# EAGLE design v1 (EAGLE 7.1.0)
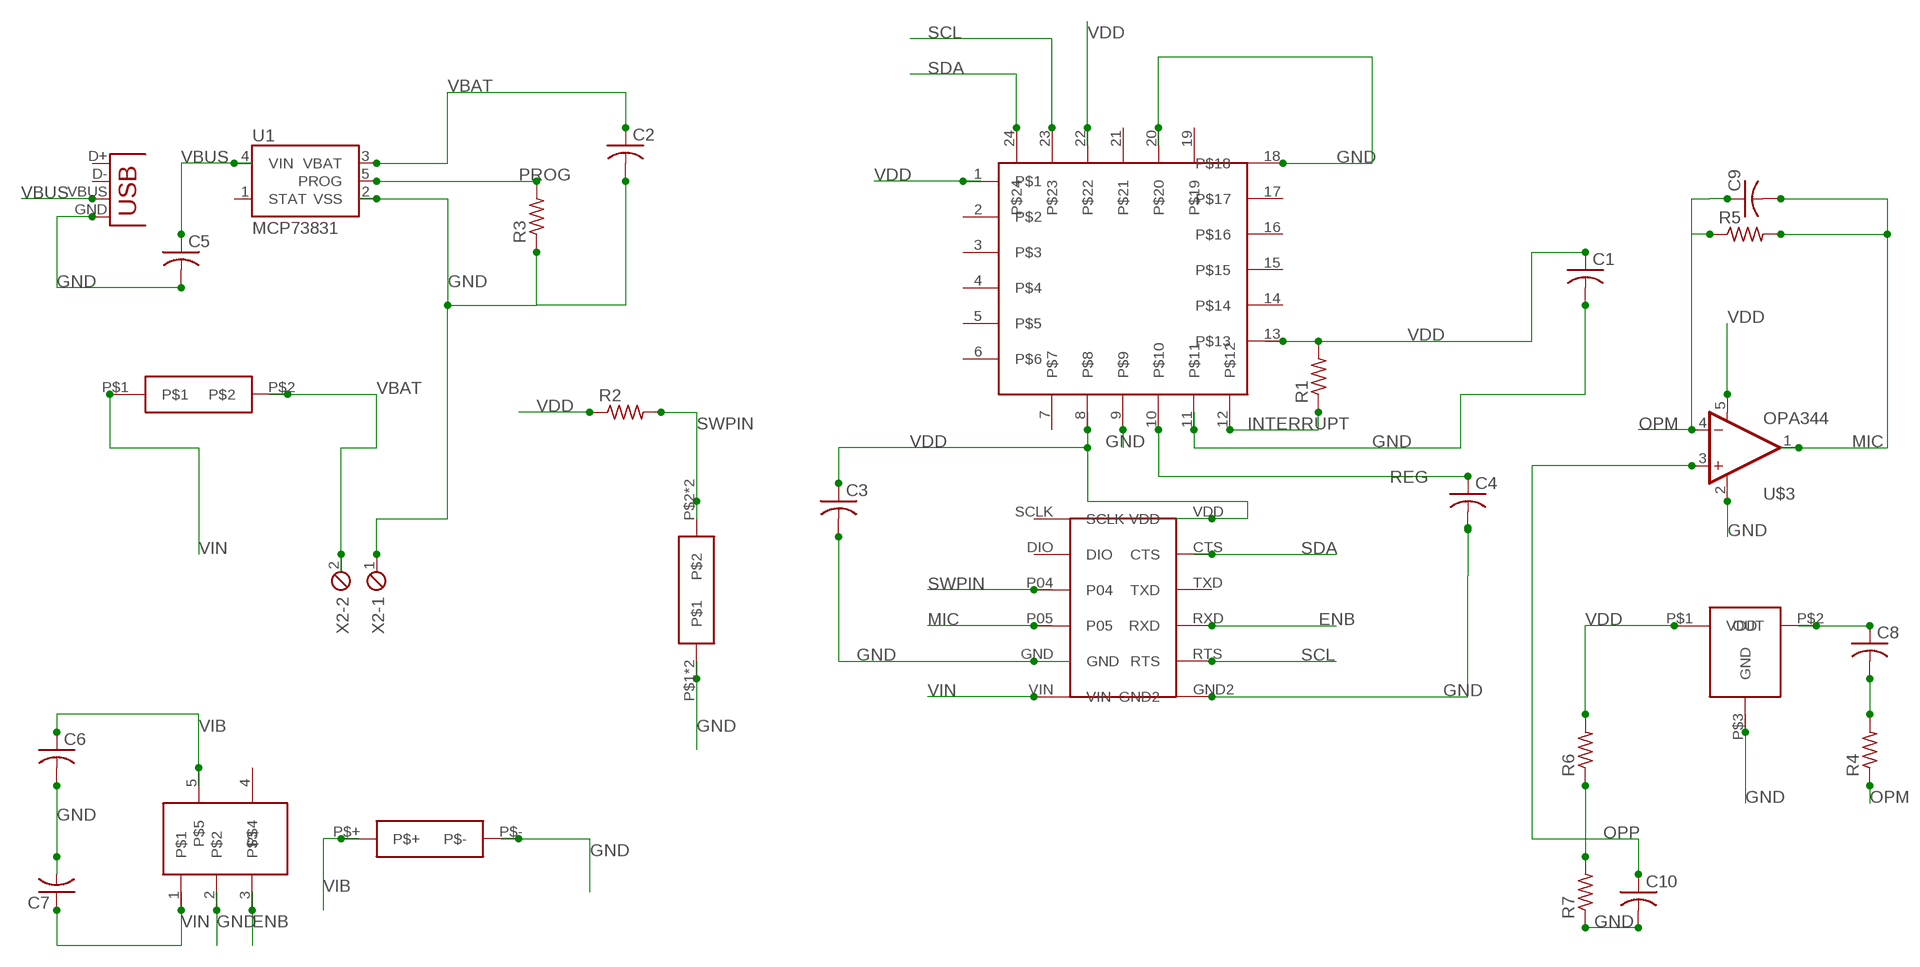
[diagram p0: schematic, sheet 1]

## Parts
C1  C-USC0402K  [C0402K]
C2  C-USC0402K  [C0402K]
C3  C-USC0402K  [C0402K]
C4  C-USC0402K  [C0402K]
C5  C-USC0402K  [C0402K]
C6  C-USC0402K  [C0402K]
C7  C-USC0402K  [C0402K]
C8  C-USC0402K  [C0402K]
C9  C-USC0402K  [C0402K]
C10  C-USC0402K  [C0402K]
R1  R-US_R0402  [R0402]
R2  R-US_R0402  [R0402]
R3  R-US_R0402  [R0402]
R4  R-US_R0402  [R0402]
R5  R-US_R0402  [R0402]
R6  R-US_R0402  [R0402]
R7  R-US_R0402  [R0402]
U1  MCP73831  [SOT23-5]
U$1  NANOBLE  [NANOBLE]
U$2  MICROPHONE  [MICROPHONE]
U$3  OPA344  [SOT23-5]
U$4  LP5907  [SOT23-5]
U$5  TACTILE  [TACTILE]
U$6  SWITCH  [SWITCH2]
U$7  VIBRATOR  [VIBRATOR]
U$8  COMPASSE  [QFN-24-USB]
X1  USB-MICROB  [USB-MICROB]
X2  MPT2  [2POL254]

## Nets
ENB: U$1.RXD U$4.3
GND: C1.2 C2.2 C3.2 C4.2 C5.2 C6.2 C7.2 C10.2 R3.1 R7.1 U1.2(VSS) U$1.GND U$1.GND2 U$2.P$3(GND) U$3.2(V-) U$4.2 U$5.P$1 U$5.P$3 U$7.P$- U$8.9 U$8.11 U$8.18 U$8.20 X1.GND X2.1
INTERRUPT: R1.1 U$8.12
MIC: C9.2 R5.2 U$1.P05 U$3.1(OUT)
N$1: C8.2 R4.2
N$3: C8.1 U$2.P$2(OUT)
OPM: C9.1 R4.1 R5.1 U$3.4(-IN)
OPP: C10.1 R6.1 R7.2 U$3.3(+IN)
PROG: R3.2 U1.5(PROG)
REG: C4.1 U$8.10
SCL: U$1.RTS U$8.23
SDA: U$1.CTS U$8.24
SWPIN: R2.2 U$1.P04 U$5.P$2 U$5.P$4
VBAT: C2.1 U1.3(VBAT) U$6.P$2 X2.2
VBUS: C5.1 U1.4(VIN) X1.VBUS
VDD: C1.1 C3.1 R1.2 R2.1 R6.2 U$1.VDD U$2.P$1(VDD) U$3.5(V+) U$8.1 U$8.8 U$8.13 U$8.22
VIB: C6.1 U$4.5 U$7.P$+
VIN: C7.1 U$1.VIN U$4.1 U$6.P$1
Unconnected: U1.1(STAT) U$1.DIO U$1.SCLK U$1.TXD U$4.4 U$8.2 U$8.3 U$8.4 U$8.5 U$8.6 U$8.7 U$8.14 U$8.15 U$8.16 U$8.17 U$8.19 U$8.21 X1.D+ X1.D-

## Library data of the parts
C1-C10 = rcl:C-US: CAPACITOR, American symbol
R1-R7 = rcl:R-US_: RESISTOR, American symbol
U1 = ahmed:MCP73831: Microchip's MCP73831 Miniature single cell, fully integrated Li-Ion, Li-polymer charge management controller http://ww1.microchip.com/downloads/en/DeviceDoc/21984a.pdf
U$1 = ahmed:NANOBLE
U$2 = ahmed:MICROPHONE
U$3 = ahmed:OPA344
U$4 = ahmed:LP5907
U$5 = ahmed:TACTILE
U$6 = ahmed:SWITCH
U$7 = ahmed:VIBRATOR
U$8 = ahmed:COMPASSE
X1 = ahmed:USB: USB Connectors USB-B-PTH is fully proven SKU : PRT-00139 USB-miniB is fully proven SKU : PRT-00587 USB-A-PCB is untested. USB-A-H is throughly reviewed, but untested. Spark Fun Electronics SKU : PRT-00437 USB-B-SMT is throughly reviewed, but untested. Needs silkscreen touching up. USB-A-S has not been used/tested USB-MB-H has not been used/tested
X2 = con-phoenix-254:MPT2: PHOENIX CONNECTOR; OC_FARNELL: unknown; OC_NEWARK: unknown

## Board
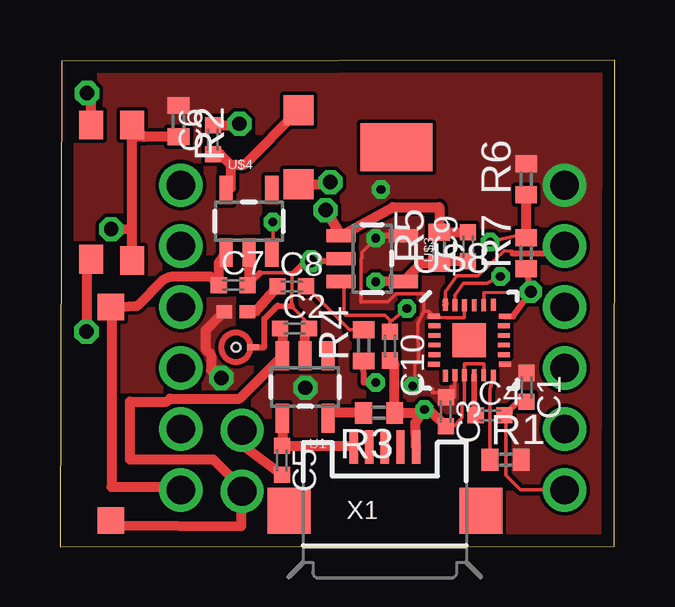
[diagram p1: board, top side]
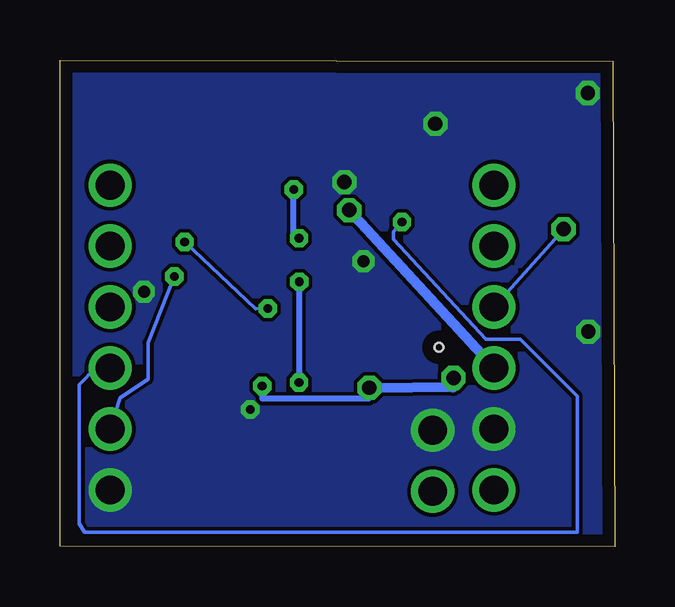
[diagram p2: board, bottom side, seen from below]

Size 23.14 x 20.29 mm. Coordinates in mm from the lower left corner, seen from the top.
Outline: 0,0 23.12,0.02 23.14,20.29 0.08,20.24 0,0
Copper layers (1*16): Top 0.0178mm / dielectric 59mil / Bottom 0.0178mm
Design rules "SSC-EAGLE-2Lyr_v1.0.0.3": minimum track width 6mil, minimum drill 14mil, track to track 6mil, track to pad 6mil, pad to pad 6mil, via to via 6mil, smd to smd 6mil, copper to edge 20mil, drill to drill 16mil, minimum pad ring 8mil, minimum via ring 8mil, stop-mask expansion 3mil, vias tented up to drill 0mil, thermal gap 10mil

### Footprints (pad centres in the part's own frame; a part is rotated, then mirrored left to right if it is on the bottom)
C0402K = smd 0.671 x 0.664: 1 -0.6,0; 2 0.6,0
R0402 = smd 0.7 x 0.9: 1 -0.65,0; 2 0.65,0
SOT23-5 = smd 0.55 x 1.2: 1 -0.95,-1.3; 2 0,-1.3; 3 0.95,-1.3; 4 0.95,1.3; 5 -0.95,1.3
NANOBLE = drill 1.2: CTS 8.001,3.81; DIO -8.001,3.81; GND -8.001,-3.81; GND2 8.001,-6.35; P04 -8.001,1.27; P05 -8.001,-1.27; RTS 8.001,-3.81; RXD 8.001,-1.27; SCLK -8.001,6.35; TXD 8.001,1.27; VDD 8.001,6.35; VIN -8.001,-6.35
MICROPHONE = smd 0.65 x 0.545: P$1 -0.475,1.478; P$2 0.475,1.478 | smd 0.5 x 0.25: P$3 0.725,0 | hole 0.36: 0,0
TACTILE = smd 1.2 x 1: P$1 2.8,0.85; P$2 2.8,-0.85; P$3 -2.8,0.85; P$4 -2.85,-0.85
SWITCH2 = smd 1.1 x 1.1: P$1 0,4.45; P$2 0,-4.45
VIBRATOR = smd 1.25 x 1.25: P$+ -1.54,-2.54; P$- 1.54,-2.54 | smd 2 x 3: USELESS 0,1.54
QFN-24-USB = smd 0.5 x 0.2: 1 -1.475,1; 2 -1.45,0.6; 3 -1.45,0.2; 4 -1.45,-0.2; 5 -1.45,-0.6; 6 -1.475,-1; 13 1.475,-1; 14 1.45,-0.6; 15 1.45,-0.2; 16 1.45,0.2; 17 1.45,0.6; 18 1.475,1 | smd 0.2 x 0.5: 7 -1,-1.475; 8 -0.6,-1.45; 9 -0.2,-1.45; 10 0.2,-1.45; 11 0.6,-1.45; 12 1,-1.475; 19 1,1.475; 20 0.6,1.45; 21 0.2,1.45; 22 -0.2,1.45; 23 -0.6,1.45; 24 -1,1.475 | smd 1.398 x 1.398: GND1 0,0; GND2 0,0
USB-MICROB = smd 0.35 x 1.4: D+ 0,2.65; D- -0.65,2.65; GND 1.3,2.65; ID 0.65,2.65; VBUS -1.3,2.65 | smd 1.8 x 1.9: MT1 -4,0; MT2 4,0
2POL254 = drill 1.2: 1 -1.27,0; 2 1.27,0

### Placement (x,y rotation side)
C1  19.45,6.65 270 top
C2  9.78,9.1 0 top
C3  16.09,5.64 270 top
C4  17.93,5.48 0 top
C5  9.25,3.61 270 top
C6  6.38,16.97 90 top
C7  7.23,10.91 0 top
C8  9.67,10.86 0 top
C9  17.02,12.51 90 top
C10  13.76,8.37 270 top
R1  18.58,3.63 0 top
R2  4.95,17.74 270 top
R3  13.31,5.59 180 top
R4  12.66,8.4 90 top
R5  15.81,12.46 90 top
R6  19.44,15.32 90 top
R7  19.44,12.24 90 top
U1  10.22,6.67 180 top
U$1  13.04,8.73 0 top
U$2  7.34,8.33 0 top
U$3  13.02,12.01 270 top
U$4  7.88,13.57 0 top
U$5  2.16,14.78 90 top
U$6  2.13,5.55 0 top
U$7  12.49,16.65 270 top
U$8  17.07,8.61 0 top
X1  13.55,1.51 0 top
X2  7.59,3.59 270 top

### Tracks (layer width: path | path; a pad name or v marks a point on that pad's centre or on a via)
ENB  (via drill 0.36)
  Top 0.154: v8.88,13.54 8.88,12.32 U$4.3
  Bottom 0.154: U$1.RXD 21.64,7.46 22.34,6.76 22.34,0.97 22.1,0.62 1.57,0.62 1.57,6.28 3.95,8.66 5.37,8.66 9.24,12.81 9.24,13.13 v8.88,13.54
GND  (via drill 0.36, 0.5, 0.6)
  Top 0.154: U$8.20 17.68,10.58 v19.64,10.63 | 8.34,11.42 9.76,11.42 9.67,11.33 9.66,10.04 10.4,9.27 C2.2 | 19.1,6.05 18.6,5.55 18.6,2.98 19.2,2.38 U$1.GND2 | 16.87,7.56 U$8.9 16.87,6.01 16.77,5.93 16.77,5.39 16.41,5.01 C3.2 | 16.87,7.56 16.94,7.64 | U$8.11 17.67,7.64 16.94,7.64 | 16.94,7.64 16.87,7.64 16.87,7.56
  Top 0.254: U$8.18 18.89,9.61 v19.64,10.63 19.47,11.56 R7.1 | C1.2 19.1,6.05 C4.2 | U$3.2 11.39,11.91 v10.48,11.9 10.24,11.9 9.76,11.42 | C7.2 8.34,11.42 | U$2.P$3 8.52,8.33 8.52,9.51 8.98,9.97 8.96,9.95 9.08,10.05 9.66,10.04
  Top 0.406: X2.1 7.62,4.24 C5.2 | U$5.P$1 1.31,18.8 v1.13,18.91 | U$5.P$3 1.11,11.82 v1.11,8.97 | C6.2 7.42,17.57 v7.49,17.63 | U$7.P$- 11,15.11 v11.28,15.2 | X1.GND 14.82,5.18 v15.2,5.73 | v15.2,5.73 15.08,5.59 R3.1 13.96,7.57 C10.2 | v15.2,5.73 15.46,5.64 C3.2 | U1.2 10.22,8.85 C2.2 | U$4.2 7.88,10.96 C7.2
  Bottom 0.254: v19.64,10.63 19.85,10.6 19.7,10.56 | v10.48,11.9 10.38,11.8
  Bottom 0.406: v1.13,18.91 1.3,18.95 | v1.11,8.97 1.09,9.16 1.08,8.99 | v7.49,17.63 v7.49,17.62 7.5,17.57 | v11.28,15.2 11.23,15.34 | v15.2,5.73 15.26,5.75 15.22,5.8
  pour Bottom (no thermals): -0.1,20.05 -0.17,0.06 22.38,-0.12 22.45,19.87
INTERRUPT
  Top 0.154: R1.1 17.92,6.53 U$8.12
MIC  (via drill 0.6)
  Top 0.406: v11.08,14.03 U$3.1 13.88,14.16 15.82,14.16 R5.2 C9.2
  Bottom 0.406: U$1.P05 v11.08,14.03
N$1
  Top 0.154: C8.2 12.08,9.05 R4.2
N$3
  Top 0.406: U$2.P$2 8.11,9.78 C8.1
OPM  (via drill 0.36)
  Top 0.254: v13.17,6.85 12.67,6.85 R4.1
  Top 0.406: C9.1 15.81,11.91 R5.1 15.06,11.81 U$3.4 v13.16,11.05
  Bottom 0.254: v13.16,11.05 13.17,6.82 v13.17,6.85
OPP  (via drill 0.36)
  Top 0.154: U$3.3 11.85,10.93 11.85,9.71 11.91,9.65 13.56,9.65 13.76,9.45 13.76,9.36 | R7.2 19.29,13.03 v17.94,12.71 | v14.47,9.94 13.76,9.36 | 13.76,9.36 C10.1
  Top 0.406: R6.1 R7.2
  Bottom 0.154: v17.94,12.71 14.98,9.93 v14.47,9.94
PROG
  Top 0.406: R3.2 11.39,5.59 U1.5
REG
  Top 0.254: U$8.10 17.27,5.55 C4.1
SCL  (via drill 0.36)
  Top 0.154: U$8.23 16.48,10.48 16.83,10.98 17.8,10.98 v18.37,11.26
  Bottom 0.154: v18.37,11.26 19.47,8.51 19.47,6.98 20.62,6.22 U$1.RTS
SDA
  Top 0.154: U$8.24 16.07,10.07 16.08,10.63 16.55,11.29 17.42,11.29 18.53,12.34 18.87,12.32 18.87,12.23
  Top 0.254: 16.07,10.22 16.07,10.07 | 18.87,12.23 20.74,12.23 U$1.CTS
SWPIN  (via drill 0.6)
  Top 0.406: R2.2 3.5,17.09 | 3.5,17.09 U$5.P$2 | 3.5,17.09 3.11,17.09 2.94,17.26 3.08,17.26 3.15,17.19 3.09,17.19 3,17.1 3,13.25 | 3,13.25 3,11.95 U$5.P$4 | v2.14,13.24 3,13.25
  Bottom 0.154: U$1.P04 v2.14,13.24
VBAT
  Top 0.406: U$6.P$2 2.33,1.16 2.33,0.91 7.57,0.87 X2.2 7.59,2.44 6.4,3.64 3.4,3.64 2.92,3.64 2.92,6.06 4.45,6.06 4.58,6.18 7.49,6.18 U1.3 9.27,9.03 C2.1
VBUS
  Top 0.406: U1.4 9.27,4.23 C5.1 12.19,4.21 X1.VBUS
VDD  (via drill 0.36, 0.6)
  Top 0.154: U$8.22 16.87,9.58 16.84,9.55 16.1,9.55 15.37,9.56 U$8.1 15.39,9.81 15.18,9.81 | v14.71,6.71 14.63,6.71 14.61,6.88 | C3.1 16.47,6.24 16.47,6.68 | U$8.8 16.47,6.68 | 16.47,6.68 16.3,6.68 16.3,6.42 15.54,6.42 15.54,6.6 14.81,6.6 14.81,7.67 14.95,7.67 14.93,9.35 15.18,9.81 | 15.18,9.81 15.18,10.55 14.01,10.55 13.67,10.21 12.58,10.21 12.55,10.2 12.55,12.01 12.59,12.03 12.59,12.28 v13.17,12.86
  Top 0.254: U$3.5 13.08,12.96 v13.17,12.86 | v13.39,14.89 13.48,14.89 13.38,14.86
  Top 0.406: U$2.P$1 6.85,9.8 6.08,9.03 6.08,8.22 6.3,8 6.3,7.37 v6.73,7.04
  Bottom 0.154: v10.24,6.63 10.26,6.18
  Bottom 0.254: v13.17,12.86 13.39,13.03 v13.39,14.89 | 10.26,6.18 14.7,6.18 v14.71,6.71
  Bottom 0.406: v6.73,7.04 6.73,6.65 10.15,6.62 10.23,6.71 v10.24,6.63
  pour Top (no thermals): -0.1,20.05 -0.15,0.03 22.38,-0.12 22.42,19.9
VIB
  Top 0.406: C6.1 6.68,16.37 7.12,15.93 | 7.12,15.93 7.12,14.95 U$4.5 | 7.12,15.93 7.69,15.93 U$7.P$+
VIN
  Top 0.406: U$1.VIN 5.04,2.51 2.15,2.51 2.15,10.06 U$6.P$1 3.23,10.06 4.33,11.15 4.52,11.23 4.69,11.27 6.26,11.27 C7.1 6.63,11.86 U$4.1